# EAGLE design VoltageRegulator (EAGLE 5.10)
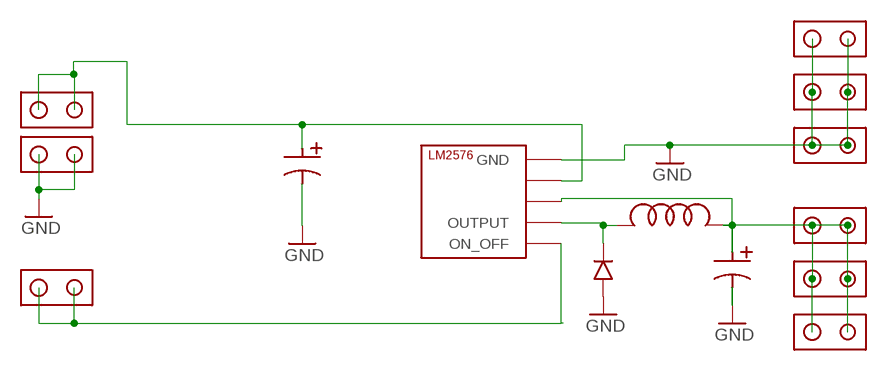
[diagram p0: schematic, sheet 1]

## Parts
CIN  PANASONIC_CAP_ECA-1EM101  [PANASONIC_LYTIC_6MM]
COUT  KEMET_CAP_ESK108M025AH4AA  [KEMET_LYTIC_10MM]
U$1  LM2576  [LM2576]
U$2  QD_KE_4966  [KEYSTONE_ELEC_4966]
U$3  QD_KE_4966  [KEYSTONE_ELEC_4966]
U$4  QD_KE_4966  [KEYSTONE_ELEC_4966]
U$5  QD_KE_4966  [KEYSTONE_ELEC_4966]
U$6  QD_KE_4966  [KEYSTONE_ELEC_4966]
U$7  QD_KE_4966  [KEYSTONE_ELEC_4966]
U$8  QD_KE_4966  [KEYSTONE_ELEC_4966]
U$9  QD_KE_4966  [KEYSTONE_ELEC_4966]
U$10  QD_KE_4966  [KEYSTONE_ELEC_4966]
U$11  DIODE_DO-41  [DO-41]
U$12  MURATA_1410454C  [MURATA_1410454C]

## Nets
GND: CIN.NEG COUT.NEG U$1.PIN3(GND) U$3.P$1 U$3.P$2 U$5.P$1 U$5.P$2 U$6.P$1 U$6.P$2 U$7.P$1 U$7.P$2 U$11.ANOD(ANODE)
N$1: U$1.PIN2(OUTPUT) U$11.CATH(CATHODE) U$12.P$1
N$3: U$1.PIN5(ON_OFF) U$4.P$1 U$4.P$2
PRE_OUT: COUT.POS U$1.PIN4(FEEDBACK) U$8.P$1 U$8.P$2 U$9.P$1 U$9.P$2 U$10.P$1 U$10.P$2 U$12.P$2
VIN: CIN.POS U$1.PIN1(VIN) U$2.P$1 U$2.P$2

## Library data of the parts
CIN = walthour:PANASONIC_CAP_ECA-1EM101
COUT = walthour:KEMET_CAP_ESK108M025AH4AA
U$1 = walthour:LM2576
U$2-U$10 = walthour:QD_KE_4966
U$11 = walthour:DIODE: A DO-41 packaged diode
U$12 = walthour:MURATA_1410454C

## Board
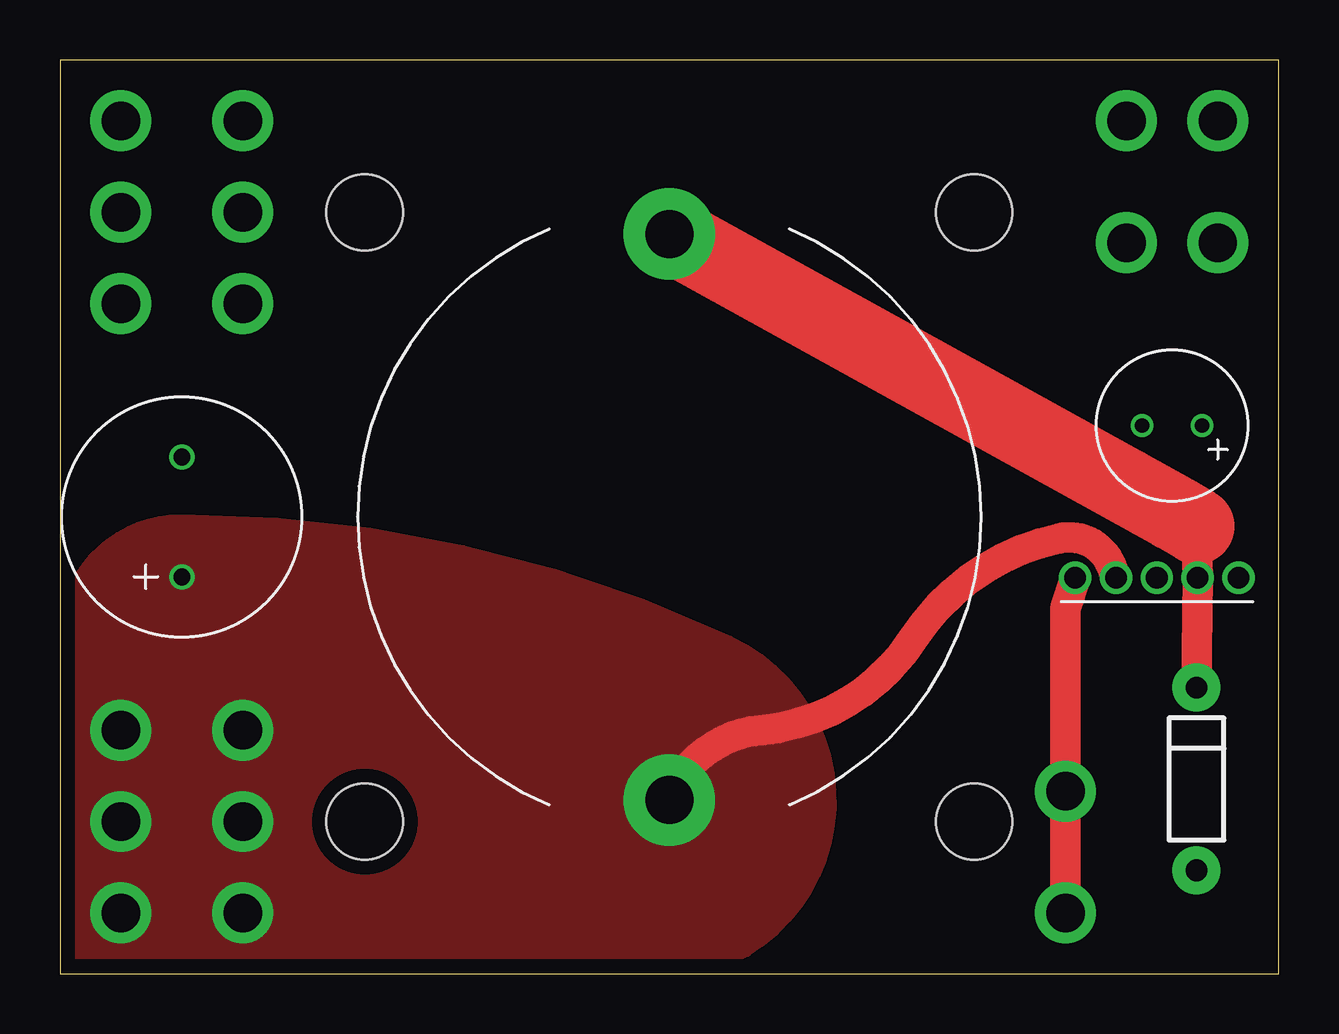
[diagram p1: board, top side]
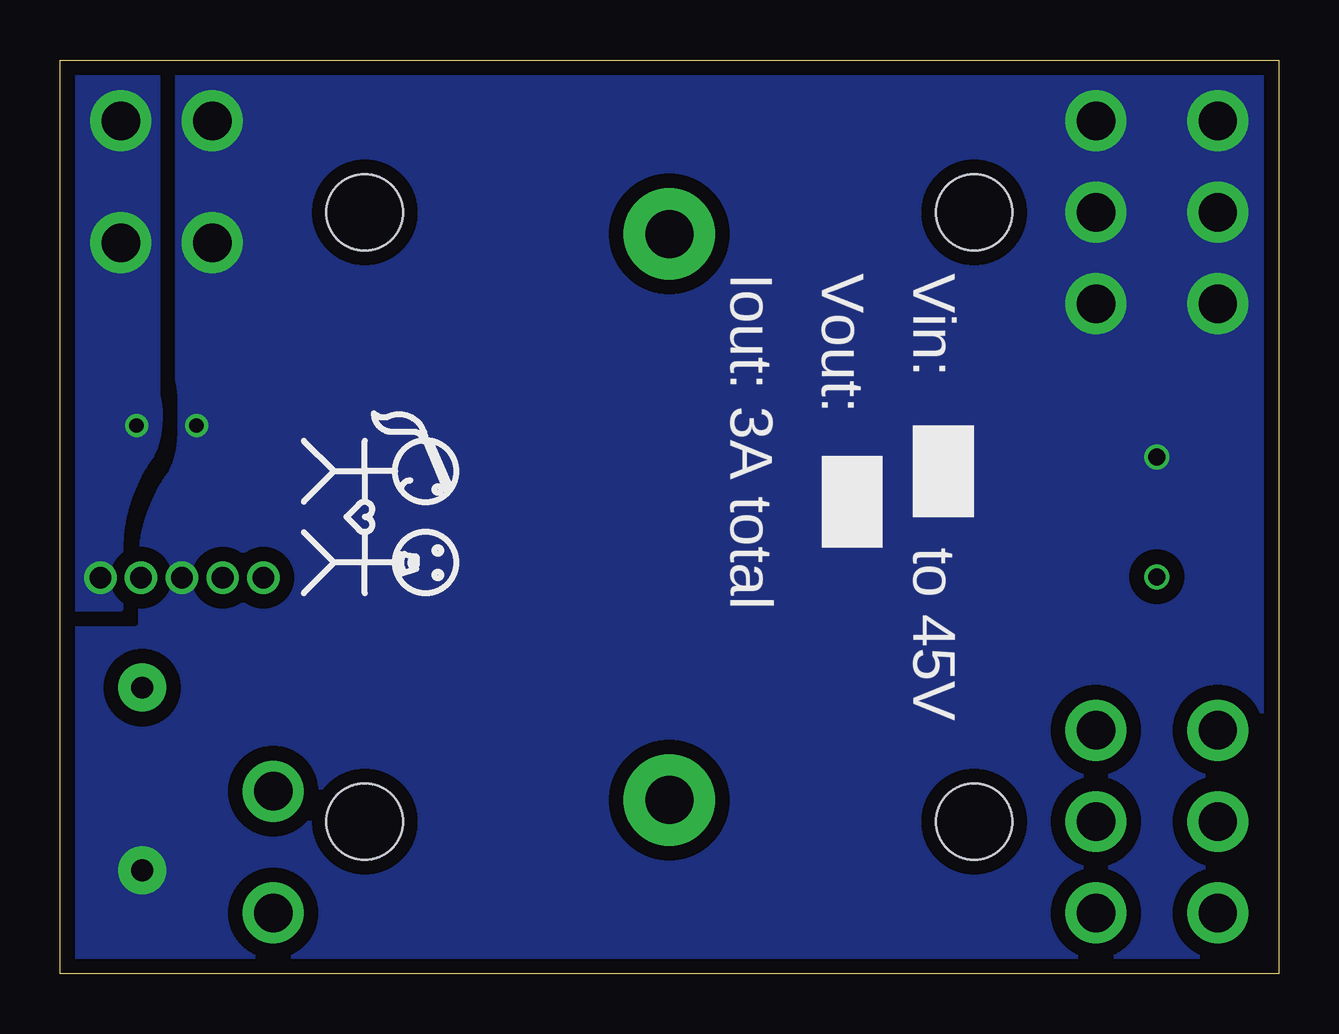
[diagram p2: board, bottom side, seen from below]

Size 50.8 x 38.1 mm. Coordinates in mm from the lower left corner, seen from the top.
Outline: 0,0 50.8,0 50.8,38.1 0,38.1 0,0
Copper layers (1*16): Top 0.0356mm / dielectric 1.5011mm / Bottom 0.0356mm
Design rules "LaenPCBOrder": minimum track width 6mil, minimum drill 13mil, track to track 6mil, track to pad 6mil, pad to pad 6mil, via to via 6mil, smd to smd 6mil, copper to edge 15mil, drill to drill 6mil, minimum pad ring 7mil, minimum via ring 7mil, stop-mask expansion 4mil, vias tented up to drill 0mil, thermal gap 10mil
Holes 3.17 mm at 38.1,6.35 38.1,31.75 12.7,31.75 12.7,6.35

### Footprints (pad centres in the part's own frame; a part is rotated, then mirrored left to right if it is on the bottom)
PANASONIC_LYTIC_6MM = drill 0.6 round: NEG 1.25,0; POS -1.25,0
KEMET_LYTIC_10MM = drill 0.7 round: NEG 2.5,0; POS -2.5,0
LM2576 = drill 0.9 round: PIN1 -3.4,0; PIN2 -1.7,0; PIN3 0,0; PIN4 1.7,0; PIN5 3.4,0
KEYSTONE_ELEC_4966 = drill 1.6 pad 2.54 round: P$1 -2.54,0; P$2 2.54,0
DO-41 = drill 0.9 pad 2 round: ANOD 3.81,0; CATH -3.81,0
MURATA_1410454C = drill 2 pad 3.81 round: P$1 11.8,0; P$2 -11.8,0

### Placement (x,y rotation side)
CIN  46.35,22.86 180 top
COUT  5.08,19.05 90 top
U$1  45.72,16.51 180 top
U$2  48.26,33.02 90 top
U$3  5.08,31.75 0 top
U$4  41.91,5.08 270 top
U$5  5.08,35.56 0 top
U$6  5.08,27.94 0 top
U$7  44.45,33.02 90 top
U$8  5.08,6.35 0 top
U$9  5.08,10.16 0 top
U$10  5.08,2.54 0 top
U$11  47.37,8.13 270 top
U$12  25.4,19.05 90 top
U$13  [EW_SILKSCREEN]  38.1,19.05 270 bottom

### Tracks (layer width: path | path; a pad name or v marks a point on that pad's centre or on a via)
GND
  pour Bottom (isolate 0.61, rank 2, no thermals): 0,38.1 50.8,38.1 50.8,0 0,0
N$1
  Top 1.27: U$11.CATH U$1.PIN2 47.37,18.67
  Top 3.175: U$12.P$1 44.45,20.32 arc-1 47.37,18.67
N$3
  Top 1.27: U$1.PIN5 41.91,15.24 U$4.P$1 U$4.P$2
PRE_OUT
  Top 1.27: U$1.PIN4 43.81,17.02 arc80 41.66,18.16 arc45 35.56,13.97 arc-52 29.21,10.16 arc64 U$12.P$2
  pour Top (isolate 0.61, no thermals): 0,0 0,13.97 arc-90 5.08,19.05 arc-25 27.94,13.97 arc-140 26.67,0
VIN
  pour Bottom (isolate 0.61, no thermals): 46.74,38.1 50.8,38.1 50.8,15.49 arc-90 50.55,15.24 48.26,15.24 48.26,17.78 arc37 46.99,21.59 arc-40 46.74,24.13

### Text on the board
bPlace: Vin: | Vout: | Iout: 3A total | to 45V